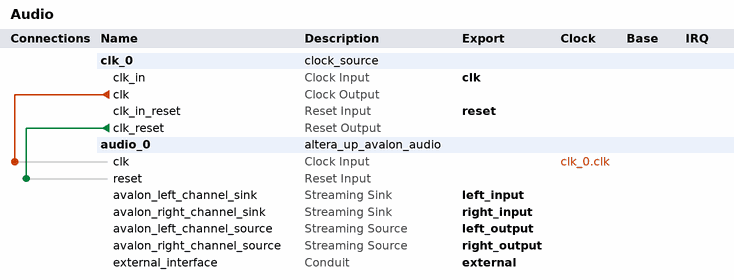
[diagram p0: system contents]
# Platform Designer (Qsys) system Audio, Cyclone V 5CSEMA5F31C6
# Parameters at their usual value, and those the tool derives, are not listed.
package require -exact qsys 17.1
create_system Audio
set_project_property DEVICE_FAMILY {Cyclone V}
set_project_property DEVICE 5CSEMA5F31C6

add_instance clk_0 clock_source 17.1
set_instance_parameter_value clk_0 clockFrequency 50000000

add_instance audio_0 altera_up_avalon_audio 17.1
set_instance_parameter_value audio_0 audio_in true
set_instance_parameter_value audio_0 avalon_bus_type Streaming
set_instance_parameter_value audio_0 dw 32

# connections
add_connection clk_0.clk audio_0.clk clock
add_connection clk_0.clk_reset audio_0.reset reset

# exported interfaces
add_interface clk clock sink
set_interface_property clk EXPORT_OF clk_0.clk_in
add_interface external conduit end
set_interface_property external EXPORT_OF audio_0.external_interface
add_interface left_input avalon_streaming sink
set_interface_property left_input EXPORT_OF audio_0.avalon_left_channel_sink
add_interface left_output avalon_streaming source
set_interface_property left_output EXPORT_OF audio_0.avalon_left_channel_source
add_interface reset reset sink
set_interface_property reset EXPORT_OF clk_0.clk_in_reset
add_interface right_input avalon_streaming sink
set_interface_property right_input EXPORT_OF audio_0.avalon_right_channel_sink
add_interface right_output avalon_streaming source
set_interface_property right_output EXPORT_OF audio_0.avalon_right_channel_source

set_interconnect_requirement {$system} qsys_mm.clockCrossingAdapter HANDSHAKE
set_interconnect_requirement {$system} qsys_mm.enableEccProtection FALSE
set_interconnect_requirement {$system} qsys_mm.insertDefaultSlave FALSE
set_interconnect_requirement {$system} qsys_mm.maxAdditionalLatency 1

save_system Audio.qsys
